# Altium schematic sheet CONNECTEUR_4.SchDoc: DARKYDEN_CONNECTEUR_4
size Letter; ApprovedBy: APPROUVÉ PAR; Author: Harold Malbrouck; Organization: Cegep Limoilou; Address1: 1300, 8e Avenue; Address2: Québec, QC; Address3: Canada; Address4: G1J 5L5; Revision: Rev.B; SheetNumber: 14; SheetTotal: 22
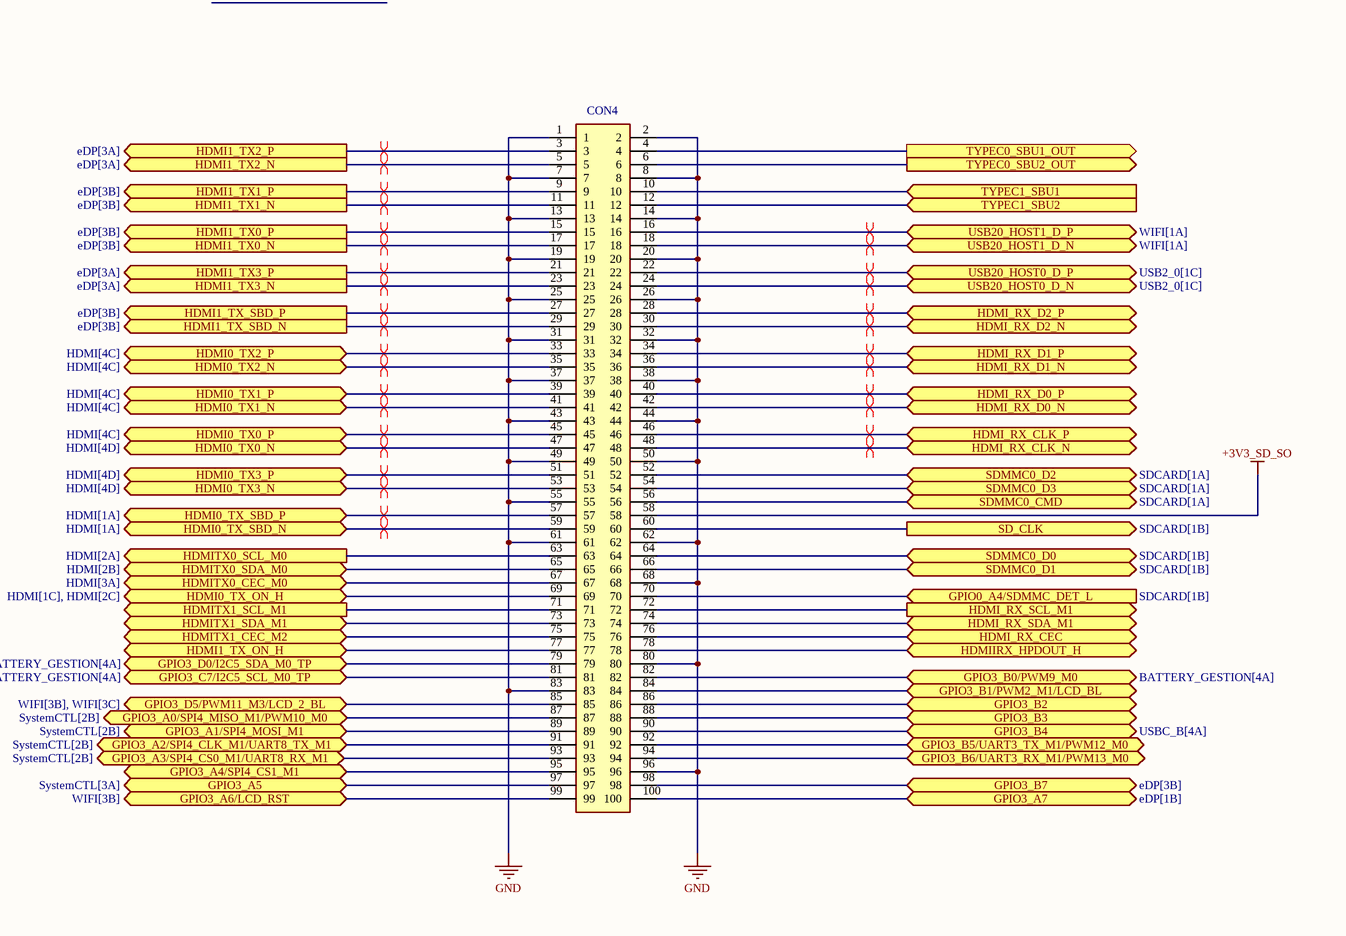
[diagram p0: CONNECTEUR_4.SchDoc, right]

## Parts
CON4  DF40HC  [DF40HC30100DS04V51]  (value not drawn)

## Ports
GPIO0_A4/SDMMC_DET_L (in, see SDCARD[1B]), GPIO3_A0/SPI4_MISO_M1/PWM10_M0 (bidir, see SystemCTL[2B]), GPIO3_A1/SPI4_MOSI_M1 (bidir, see SystemCTL[2B]), GPIO3_A2/SPI4_CLK_M1/UART8_TX_M1 (bidir, see SystemCTL[2B]), GPIO3_A3/SPI4_CS0_M1/UART8_RX_M1 (bidir, see SystemCTL[2B]), GPIO3_A4/SPI4_CS1_M1 (bidir), GPIO3_A5 (bidir, see SystemCTL[3A]), GPIO3_A6/LCD_RST (bidir, see WIFI[3B]), GPIO3_A7 (bidir, see eDP[1B]), GPIO3_B0/PWM9_M0 (bidir, see BATTERY_GESTION[4A]), GPIO3_B1/PWM2_M1/LCD_BL (bidir), GPIO3_B2 (bidir), GPIO3_B3 (bidir), GPIO3_B4 (bidir, see USBC_B[4A]), GPIO3_B5/UART3_TX_M1/PWM12_M0 (bidir), GPIO3_B6/UART3_RX_M1/PWM13_M0 (bidir), GPIO3_B7 (bidir, see eDP[3B]), GPIO3_C7/I2C5_SCL_M0_TP (bidir, see BATTERY_GESTION[4A]), GPIO3_D0/I2C5_SDA_M0_TP (bidir, see BATTERY_GESTION[4A]), GPIO3_D5/PWM11_M3/LCD_2_BL (bidir, see WIFI[3B], WIFI[3C]), HDMI0_TX0_N (bidir, see HDMI[4D]), HDMI0_TX0_P (bidir, see HDMI[4C]), HDMI0_TX1_N (bidir, see HDMI[4C]), HDMI0_TX1_P (bidir, see HDMI[4C]), HDMI0_TX2_N (bidir, see HDMI[4C]), HDMI0_TX2_P (bidir, see HDMI[4C]), HDMI0_TX3_N (bidir, see HDMI[4D]), HDMI0_TX3_P (bidir, see HDMI[4D]), HDMI0_TX_ON_H (bidir, see HDMI[1C], HDMI[2C]), HDMI0_TX_SBD_N (bidir, see HDMI[1A]), HDMI0_TX_SBD_P (bidir, see HDMI[1A]), HDMI1_TX0_N (out, see eDP[3B]), HDMI1_TX0_P (out, see eDP[3B]), HDMI1_TX1_N (out, see eDP[3B]), HDMI1_TX1_P (out, see eDP[3B]), HDMI1_TX2_N (out, see eDP[3A]), HDMI1_TX2_P (out, see eDP[3A]), HDMI1_TX3_N (out, see eDP[3A]), HDMI1_TX3_P (out, see eDP[3A]), HDMI1_TX_ON_H (bidir), HDMI1_TX_SBD_N (out, see eDP[3B]), HDMI1_TX_SBD_P (out, see eDP[3B]), HDMI_RX_CEC (bidir), HDMI_RX_CLK_N (bidir), HDMI_RX_CLK_P (bidir), HDMI_RX_D0_N (bidir), HDMI_RX_D0_P (bidir), HDMI_RX_D1_N (bidir), HDMI_RX_D1_P (bidir), HDMI_RX_D2_N (bidir), HDMI_RX_D2_P (bidir), HDMI_RX_SCL_M1 (out), HDMI_RX_SDA_M1 (bidir), HDMIIRX_HPDOUT_H (bidir), HDMITX0_CEC_M0 (bidir, see HDMI[3A]), HDMITX0_SCL_M0 (out, see HDMI[2A]), HDMITX0_SDA_M0 (bidir, see HDMI[2B]), HDMITX1_CEC_M2 (bidir), HDMITX1_SCL_M1 (out), HDMITX1_SDA_M1 (bidir), SD_CLK (out, see SDCARD[1B]), SDMMC0_CMD (bidir, see SDCARD[1A]), SDMMC0_D0 (bidir, see SDCARD[1B]), SDMMC0_D1 (bidir, see SDCARD[1B]), SDMMC0_D2 (bidir, see SDCARD[1A]), SDMMC0_D3 (bidir, see SDCARD[1A]), TYPEC0_SBU1_OUT (out), TYPEC0_SBU2_OUT (out), TYPEC1_SBU1 (in), TYPEC1_SBU2 (in), USB20_HOST0_D_N (bidir, see USB2_0[1C]), USB20_HOST0_D_P (bidir, see USB2_0[1C]), USB20_HOST1_D_N (bidir, see WIFI[1A]), USB20_HOST1_D_P (bidir, see WIFI[1A])

## Nets
+3V3_SD_SO: CON4.58
GND: CON4.1 CON4.2 CON4.7 CON4.8 CON4.13 CON4.14 CON4.19 CON4.20 CON4.25 CON4.26 CON4.31 CON4.32 CON4.37 CON4.38 CON4.43 CON4.44 CON4.49 CON4.50 CON4.55 CON4.61 CON4.62 CON4.68 CON4.80 CON4.83 CON4.96
GPIO0_A4/SDMMC_DET_L: CON4.70 ; port GPIO0_A4/SDMMC_DET_L
GPIO3_A0/SPI4_MISO_M1/PWM10_M0: CON4.87 ; port GPIO3_A0/SPI4_MISO_M1/PWM10_M0
GPIO3_A1/SPI4_MOSI_M1: CON4.89 ; port GPIO3_A1/SPI4_MOSI_M1
GPIO3_A2/SPI4_CLK_M1/UART8_TX_M1: CON4.91 ; port GPIO3_A2/SPI4_CLK_M1/UART8_TX_M1
GPIO3_A3/SPI4_CS0_M1/UART8_RX_M1: CON4.93 ; port GPIO3_A3/SPI4_CS0_M1/UART8_RX_M1
GPIO3_A4/SPI4_CS1_M1: CON4.95 ; port GPIO3_A4/SPI4_CS1_M1
GPIO3_A5: CON4.97 ; port GPIO3_A5
GPIO3_A6/LCD_RST: CON4.99 ; port GPIO3_A6/LCD_RST
GPIO3_A7: CON4.100 ; port GPIO3_A7
GPIO3_B0/PWM9_M0: CON4.82 ; port GPIO3_B0/PWM9_M0
GPIO3_B1/PWM2_M1/LCD_BL: CON4.84 ; port GPIO3_B1/PWM2_M1/LCD_BL
GPIO3_B2: CON4.86 ; port GPIO3_B2
GPIO3_B3: CON4.88 ; port GPIO3_B3
GPIO3_B4: CON4.90 ; port GPIO3_B4
GPIO3_B5/UART3_TX_M1/PWM12_M0: CON4.92 ; port GPIO3_B5/UART3_TX_M1/PWM12_M0
GPIO3_B6/UART3_RX_M1/PWM13_M0: CON4.94 ; port GPIO3_B6/UART3_RX_M1/PWM13_M0
GPIO3_B7: CON4.98 ; port GPIO3_B7
GPIO3_C7/I2C5_SCL_M0_TP: CON4.81 ; port GPIO3_C7/I2C5_SCL_M0_TP
GPIO3_D0/I2C5_SDA_M0_TP: CON4.79 ; port GPIO3_D0/I2C5_SDA_M0_TP
GPIO3_D5/PWM11_M3/LCD_2_BL: CON4.85 ; port GPIO3_D5/PWM11_M3/LCD_2_BL
HDMI0_TX0_N: CON4.47 ; port HDMI0_TX0_N
HDMI0_TX0_P: CON4.45 ; port HDMI0_TX0_P
HDMI0_TX1_N: CON4.41 ; port HDMI0_TX1_N
HDMI0_TX1_P: CON4.39 ; port HDMI0_TX1_P
HDMI0_TX2_N: CON4.35 ; port HDMI0_TX2_N
HDMI0_TX2_P: CON4.33 ; port HDMI0_TX2_P
HDMI0_TX3_N: CON4.53 ; port HDMI0_TX3_N
HDMI0_TX3_P: CON4.51 ; port HDMI0_TX3_P
HDMI0_TX_ON_H: CON4.69 ; port HDMI0_TX_ON_H
HDMI0_TX_SBD_N: CON4.59 ; port HDMI0_TX_SBD_N
HDMI0_TX_SBD_P: CON4.57 ; port HDMI0_TX_SBD_P
HDMI1_TX0_N: CON4.17 ; port HDMI1_TX0_N
HDMI1_TX0_P: CON4.15 ; port HDMI1_TX0_P
HDMI1_TX1_N: CON4.11 ; port HDMI1_TX1_N
HDMI1_TX1_P: CON4.9 ; port HDMI1_TX1_P
HDMI1_TX2_N: CON4.5 ; port HDMI1_TX2_N
HDMI1_TX2_P: CON4.3 ; port HDMI1_TX2_P
HDMI1_TX3_N: CON4.23 ; port HDMI1_TX3_N
HDMI1_TX3_P: CON4.21 ; port HDMI1_TX3_P
HDMI1_TX_ON_H: CON4.77 ; port HDMI1_TX_ON_H
HDMI1_TX_SBD_N: CON4.29 ; port HDMI1_TX_SBD_N
HDMI1_TX_SBD_P: CON4.27 ; port HDMI1_TX_SBD_P
HDMI_RX_CEC: CON4.76 ; port HDMI_RX_CEC
HDMI_RX_CLK_N: CON4.48 ; port HDMI_RX_CLK_N
HDMI_RX_CLK_P: CON4.46 ; port HDMI_RX_CLK_P
HDMI_RX_D0_N: CON4.42 ; port HDMI_RX_D0_N
HDMI_RX_D0_P: CON4.40 ; port HDMI_RX_D0_P
HDMI_RX_D1_N: CON4.36 ; port HDMI_RX_D1_N
HDMI_RX_D1_P: CON4.34 ; port HDMI_RX_D1_P
HDMI_RX_D2_N: CON4.30 ; port HDMI_RX_D2_N
HDMI_RX_D2_P: CON4.28 ; port HDMI_RX_D2_P
HDMI_RX_SCL_M1: CON4.72 ; port HDMI_RX_SCL_M1
HDMI_RX_SDA_M1: CON4.74 ; port HDMI_RX_SDA_M1
HDMIIRX_HPDOUT_H: CON4.78 ; port HDMIIRX_HPDOUT_H
HDMITX0_CEC_M0: CON4.67 ; port HDMITX0_CEC_M0
HDMITX0_SCL_M0: CON4.63 ; port HDMITX0_SCL_M0
HDMITX0_SDA_M0: CON4.65 ; port HDMITX0_SDA_M0
HDMITX1_CEC_M2: CON4.75 ; port HDMITX1_CEC_M2
HDMITX1_SCL_M1: CON4.71 ; port HDMITX1_SCL_M1
HDMITX1_SDA_M1: CON4.73 ; port HDMITX1_SDA_M1
SD_CLK: CON4.60 ; port SD_CLK
SDMMC0_CMD: CON4.56 ; port SDMMC0_CMD
SDMMC0_D0: CON4.64 ; port SDMMC0_D0
SDMMC0_D1: CON4.66 ; port SDMMC0_D1
SDMMC0_D2: CON4.52 ; port SDMMC0_D2
SDMMC0_D3: CON4.54 ; port SDMMC0_D3
TYPEC0_SBU1_OUT: CON4.4 ; port TYPEC0_SBU1_OUT
TYPEC0_SBU2_OUT: CON4.6 ; port TYPEC0_SBU2_OUT
TYPEC1_SBU1: CON4.10 ; port TYPEC1_SBU1
TYPEC1_SBU2: CON4.12 ; port TYPEC1_SBU2
USB20_HOST0_D_N: CON4.24 ; port USB20_HOST0_D_N
USB20_HOST0_D_P: CON4.22 ; port USB20_HOST0_D_P
USB20_HOST1_D_N: CON4.18 ; port USB20_HOST1_D_N
USB20_HOST1_D_P: CON4.16 ; port USB20_HOST1_D_P

## Layout directives
differential pair: HDMI0_TX0_N, HDMI0_TX0_P, HDMI0_TX1_N, HDMI0_TX1_P, HDMI0_TX2_N, HDMI0_TX2_P, HDMI0_TX3_N, HDMI0_TX3_P, HDMI0_TX_SBD_N, HDMI0_TX_SBD_P, HDMI1_TX0_N, HDMI1_TX0_P, HDMI1_TX1_N, HDMI1_TX1_P, HDMI1_TX2_N, HDMI1_TX2_P, HDMI1_TX3_N, HDMI1_TX3_P, HDMI1_TX_SBD_N, HDMI1_TX_SBD_P, HDMI_RX_CLK_N, HDMI_RX_CLK_P, HDMI_RX_D0_N, HDMI_RX_D0_P, HDMI_RX_D1_N, HDMI_RX_D1_P, HDMI_RX_D2_N, HDMI_RX_D2_P, USB20_HOST0_D_N, USB20_HOST0_D_P, USB20_HOST1_D_N, USB20_HOST1_D_P

## Notes on the sheet
- Titre :
- Conception :
- Date :
- Approbation :
- Heure :
- Révision :
- Feuille
- de
- Fichier :

## Library data of the parts
CON4 = DF40HC(3.0)-100DS-0.4V(51): Stacking Board Connector, DF40 Series, Receptacle, 0.4 mm, 100, Surface Mount, G; Manufacturer_Name: Hirose; Number of Positions: 100; Contact Resistance: 90mR; Contact Voltage Rating (AC): 30V; Current Rating: 300mA; Mated Stacking Heights: 3mm; Contact Pitch: 400um; Datasheet Link: https://componentsearchengine.com/Datasheets/1/DF40HC(3.0)-100DS-0.4V(51.pdf; Height: 3.05mm; Manufacturer_Part_Number: DF40HC(3.0)-100DS-0.4V(51; Mouser Part Number: 798-DF40HC30100DS451; Mouser Price/Stock: https://www.mouser.co.uk/ProductDetail/Hirose-Connector/DF40HC3.0-100DS-0.4V51?qs=%252BAZVS4b%2FkgIV%252B3vHYy2dCA%3D%3D; Arrow Part Number: DF40HC(3.0)-100DS-0.4V(51; Arrow Price/Stock: https://www.arrow.com/en/products/df40hc-3.0-100ds-0.4v-51/hirose-electric; Supplier: Digikey; Supplier Part Number: 26-DF40HC(3.0)-100DS-0.4V(51)CT-ND; Manufacturer: Hirose; Manufacturer Part Number: DF40HC(3.0)-100DS-0.4V(51; RoHS: Yes; Category: Headers and Wire Housings; Stock: 5604; Pricing: 1=2.61, 10=2.219, 25=2.0796, 50=1.9804, 100=1.8858, 250=1.76764, 500=1.68326, 1000=1.6524 (USD); Mounting Technology: Surface Mount; Contact Plating: Gold; Contact Material: Nickel,Gold; Housing Color: Black; Min Operating Temperature: -35°C; Max Operating Temperature: 85°C; Package Quantity: 3000; Packaging: Tape and Reel; Number of Rows: 2; Connector Type: Receptacle; Series: DF40; Contact Voltage Rating (DC): 30V; Number of Contacts: 100; Orientation: Straight; Voltage Rating: 30V; Length: 22.6mm; Width: 3.38mm; ComponentLink1URL: https://datasheet.ciiva.com/13559/ed-df40-20140305-13559540.pdf?src-supplier=Mouser; ComponentLink1Description: https://datasheet.ciiva.com/13559/ed-df40-20140305-13559540.pdf?src-supplier=Mouser